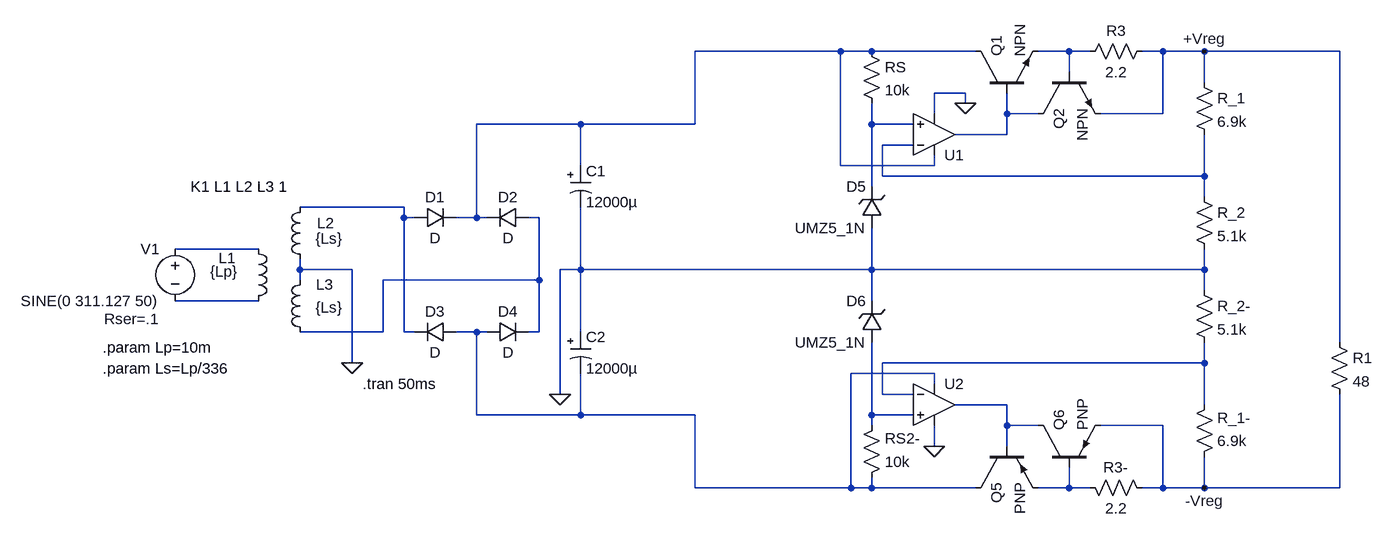
[diagram p0: schematic Power Supply - No IC.asc]
Power Supply - No IC.asc, the LTspice schematic file:
Version 4.1
SHEET 1 2676 776
WIRE 896 -192 672 -192
WIRE 944 -192 896 -192
WIRE 1104 -192 944 -192
WIRE 1248 -192 1200 -192
WIRE 1280 -192 1248 -192
WIRE 1392 -192 1360 -192
WIRE 1456 -192 1392 -192
WIRE 1664 -192 1456 -192
WIRE 1248 -160 1248 -192
WIRE 1456 -144 1456 -192
WIRE 1088 -128 1040 -128
WIRE 1088 -112 1088 -128
WIRE 1040 -96 1040 -128
WIRE 1152 -96 1152 -128
WIRE 1200 -96 1152 -96
WIRE 1392 -96 1392 -192
WIRE 1392 -96 1296 -96
WIRE 496 -80 336 -80
WIRE 672 -80 672 -192
WIRE 672 -80 496 -80
WIRE 944 -80 944 -112
WIRE 1008 -80 944 -80
WIRE 1152 -64 1152 -96
WIRE 1152 -64 1072 -64
WIRE 1008 -48 960 -48
WIRE 496 -16 496 -80
WIRE 896 -16 896 -192
WIRE 1040 -16 1040 -32
WIRE 1040 -16 896 -16
WIRE 960 0 960 -48
WIRE 1456 0 1456 -64
WIRE 1456 0 960 0
WIRE 944 16 944 -80
WIRE 1456 32 1456 0
WIRE 224 48 64 48
WIRE 224 64 224 48
WIRE 240 64 224 64
WIRE 336 64 336 -80
WIRE 336 64 304 64
WIRE 352 64 336 64
WIRE 432 64 416 64
WIRE 0 112 -128 112
WIRE 64 144 64 128
WIRE 144 144 64 144
WIRE 496 144 496 48
WIRE 496 144 464 144
WIRE 944 144 944 80
WIRE 944 144 496 144
WIRE 1456 144 1456 112
WIRE 1456 144 944 144
WIRE 64 160 64 144
WIRE 432 160 432 64
WIRE 432 160 192 160
WIRE 1456 176 1456 144
WIRE 0 192 -128 192
WIRE 944 192 944 144
WIRE 192 240 192 160
WIRE 192 240 64 240
WIRE 224 240 224 64
WIRE 240 240 224 240
WIRE 336 240 304 240
WIRE 352 240 336 240
WIRE 432 240 432 160
WIRE 432 240 416 240
WIRE 496 240 496 144
WIRE 1664 256 1664 -192
WIRE 144 288 144 144
WIRE 1456 288 1456 256
WIRE 1456 288 960 288
WIRE 1040 304 912 304
WIRE 1040 320 1040 304
WIRE 464 336 464 144
WIRE 960 336 960 288
WIRE 1008 336 960 336
WIRE 1152 352 1072 352
WIRE 1456 352 1456 288
WIRE 336 368 336 240
WIRE 496 368 496 304
WIRE 496 368 336 368
WIRE 672 368 496 368
WIRE 944 368 944 256
WIRE 1008 368 944 368
WIRE 944 384 944 368
WIRE 1152 384 1152 352
WIRE 1200 384 1152 384
WIRE 1392 384 1296 384
WIRE 1040 416 1040 384
WIRE 1152 416 1152 384
WIRE 672 480 672 368
WIRE 912 480 912 304
WIRE 912 480 672 480
WIRE 944 480 944 464
WIRE 944 480 912 480
WIRE 1104 480 944 480
WIRE 1248 480 1248 448
WIRE 1248 480 1200 480
WIRE 1280 480 1248 480
WIRE 1392 480 1392 384
WIRE 1392 480 1360 480
WIRE 1456 480 1456 432
WIRE 1456 480 1392 480
WIRE 1664 480 1664 336
WIRE 1664 480 1456 480
FLAG 464 336 0
FLAG 144 288 0
FLAG 1088 -112 0
FLAG 1040 416 0
FLAG 1456 -192 +Vreg
FLAG 1456 480 -Vreg
SYMBOL diode 240 80 R270
WINDOW 0 32 32 VTop 2
WINDOW 3 0 32 VBottom 2
SYMATTR InstName D1
SYMBOL diode 416 80 M270
WINDOW 0 32 32 VTop 2
WINDOW 3 0 32 VBottom 2
SYMATTR InstName D2
SYMBOL diode 304 256 M270
WINDOW 0 32 32 VTop 2
WINDOW 3 0 32 VBottom 2
SYMATTR InstName D3
SYMBOL diode 352 256 R270
WINDOW 0 32 32 VTop 2
WINDOW 3 0 32 VBottom 2
SYMATTR InstName D4
SYMBOL polcap 480 -16 R0
SYMATTR InstName C1
SYMATTR Value 12000µ
SYMBOL polcap 480 240 R0
SYMATTR InstName C2
SYMATTR Value 12000µ
SYMBOL voltage -128 96 M0
WINDOW 123 0 0 Left 0
WINDOW 39 24 124 Left 2
SYMATTR SpiceLine Rser=.1
SYMATTR InstName V1
SYMATTR Value SINE(0 311.127 50)
SYMBOL ind -16 208 M180
WINDOW 0 -45 82 Left 2
WINDOW 3 -58 61 Left 2
SYMATTR InstName L1
SYMATTR Value {Lp}
SYMATTR SpiceLine Rser=1m
SYMBOL ind 80 144 R180
WINDOW 0 -37 72 Left 2
WINDOW 3 -50 48 Left 2
SYMATTR InstName L2
SYMATTR Value {Ls}
SYMATTR SpiceLine Rser=1m
SYMBOL ind 80 256 R180
WINDOW 0 -36 89 Left 2
WINDOW 3 -50 54 Left 2
SYMATTR InstName L3
SYMATTR Value {Ls}
SYMATTR SpiceLine Rser=1m
SYMBOL npn 1104 -128 R270
SYMATTR InstName Q1
SYMBOL npn 1200 -160 M90
SYMATTR InstName Q2
SYMBOL res 1376 -208 R90
WINDOW 0 0 56 VBottom 2
WINDOW 3 32 56 VTop 2
SYMATTR InstName R3
SYMATTR Value 2.2
SYMBOL res 1440 -160 R0
SYMATTR InstName R_1
SYMATTR Value 6.9k
SYMBOL res 1440 16 R0
SYMATTR InstName R_2
SYMATTR Value 5.1k
SYMBOL res 928 -208 R0
SYMATTR InstName RS
SYMATTR Value 10k
SYMBOL sym\\ZZZ\\OpAmps\\UniversalOpamp 1040 -64 M180
SYMATTR InstName U1
SYMBOL res 1376 496 M270
WINDOW 0 32 56 VTop 2
WINDOW 3 0 56 VBottom 2
SYMATTR InstName R3-
SYMATTR Value 2.2
SYMBOL res 1440 448 M180
WINDOW 0 36 76 Left 2
WINDOW 3 36 40 Left 2
SYMATTR InstName R_1-
SYMATTR Value 6.9k
SYMBOL res 928 480 M180
WINDOW 0 36 76 Left 2
WINDOW 3 36 40 Left 2
SYMATTR InstName RS2-
SYMATTR Value 10k
SYMBOL sym\\ZZZ\\OpAmps\\UniversalOpamp 1040 352 R0
SYMATTR InstName U2
SYMBOL pnp 1104 416 M90
SYMATTR InstName Q5
SYMBOL pnp 1200 448 R270
SYMATTR InstName Q6
SYMBOL res 1440 160 R0
SYMATTR InstName R_2-
SYMATTR Value 5.1k
SYMBOL zener 960 80 R180
WINDOW 0 24 64 Left 2
WINDOW 3 24 0 Left 2
SYMATTR InstName D5
SYMATTR Value UMZ5_1N
SYMBOL zener 960 256 R180
WINDOW 0 24 64 Left 2
WINDOW 3 24 0 Left 2
SYMATTR InstName D6
SYMATTR Value UMZ5_1N
SYMBOL res 1648 240 R0
SYMATTR InstName R1
SYMATTR Value 48
TEXT 160 320 Left 2 !.tran 50ms
TEXT -104 16 Left 2 !K1 L1 L2 L3 1
TEXT -240 264 Left 2 !.param Lp=10m
TEXT -240 296 Left 2 !.param Ls=Lp/336

The netlist it stands for:
* Power Supply - No IC.asc
D1 N006 N001 D
D2 N007 N001 D
D3 N010 N006 D
D4 N010 N007 D
C1 N001 0 12000µ
C2 0 N010 12000µ
V1 N008 N009 SINE(0 311.127 50) Rser=.1
L1 N009 N008 {Lp} Rser=1m
L2 0 N006 {Ls} Rser=1m
L3 N007 0 {Ls} Rser=1m
Q1 N001 N003 N002 0 NPN
Q2 N003 N002 +Vreg 0 NPN
R3 +Vreg N002 2.2
R_1 +Vreg N005 6.9k
R_2 N005 0 5.1k
RS N001 N004 10k
X§U1 N004 N005 N001 0 N003 level1 Avol=1Meg GBW=10Meg Vos=0 En=0 Enk=0 In=0 Ink=0 Rin=500Meg  ; pins In+ In- V+ V- OUT
R3- -Vreg N014 2.2
R_1- -Vreg N011 6.9k
RS2- N010 N013 10k
X§U2 N013 N011 N010 0 N012 level1 Avol=1Meg GBW=10Meg Vos=0 En=0 Enk=0 In=0 Ink=0 Rin=500Meg  ; pins In+ In- V+ V- OUT
Q5 N010 N012 N014 0 PNP
Q6 N012 N014 -Vreg 0 PNP
R_2- 0 N011 5.1k
D5 0 N004 UMZ5_1N
D6 N013 0 UMZ5_1N
R1 +Vreg -Vreg 48
.model D D
.lib standard.dio
.model NPN NPN
.model PNP PNP
.lib standard.bjt
.tran 50ms
K1 L1 L2 L3 1
.param Lp=10m
.param Ls=Lp/336
.lib UniversalOpAmp1.lib
.backanno
.end